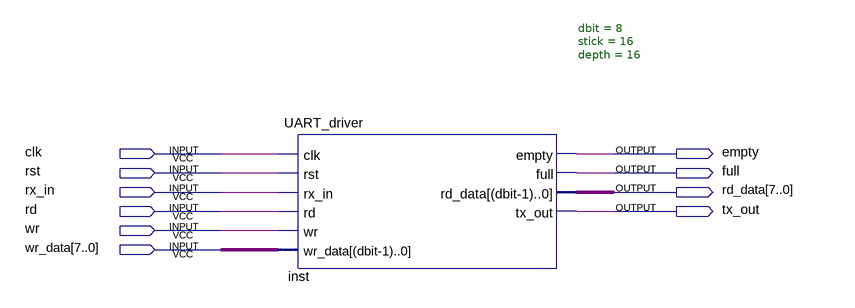
[diagram p0: schematic sheet]
// Quartus schematic UART.bdf as structural Verilog: 1 symbols, 10 pins
module UART (
  input  clk,
  input  rst,
  input  rx_in,
  input  rd,
  input  wr,
  input  [7:0] wr_data,
  output empty,
  output full,
  output [7:0] rd_data,
  output tx_out
);

  UART_driver #(.dbit(8), .stick(16), .depth(16)) inst (
    .clk(clk), .rst(rst), .rx_in(rx_in), .rd(rd), .wr(wr), .wr_data(wr_data), .empty(empty), .full(full),
    .rd_data(rd_data), .tx_out(tx_out));
endmodule
